# EAGLE schematic sx1509-breakout (EAGLE 7.1.0)
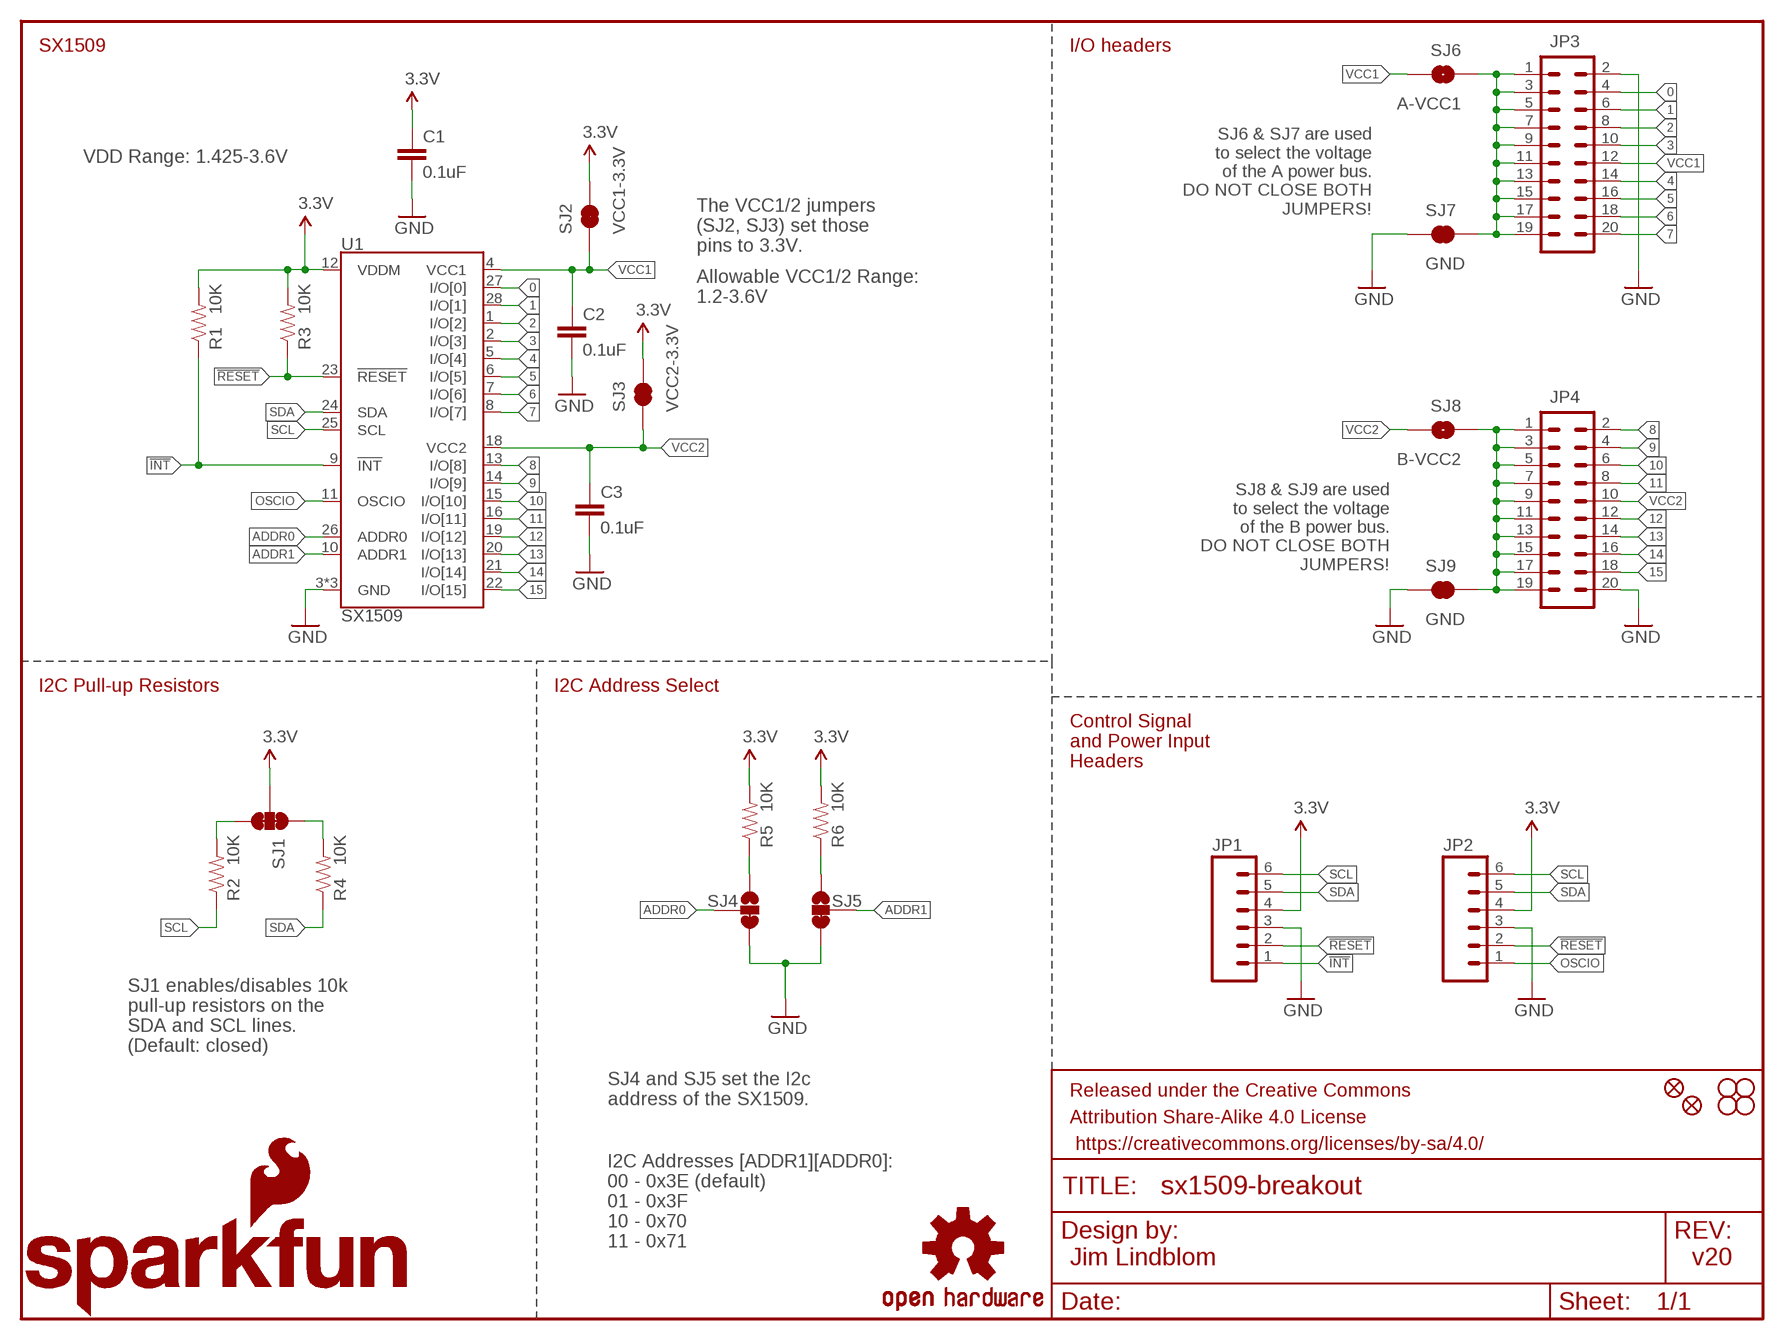
[diagram p0: schematic, sheet 1]

## Parts
C1  0.1uF  0.1UF-25V(+80/-20%)(0603)  [0603-CAP]
C2  0.1uF  0.1UF-25V(+80/-20%)(0603)  [0603-CAP]
C3  0.1uF  0.1UF-25V(+80/-20%)(0603)  [0603-CAP]
FRAME1  FRAME-LETTER  [CREATIVE_COMMONS]
JP1  M06SILK_FEMALE_PTH  [1X06]
JP2  M06SILK_FEMALE_PTH  [1X06]
JP3  M10X2ROUND_NOSILK  [2X10_ROUND_NOSILK]
JP4  M10X2ROUND_NOSILK  [2X10_ROUND_NOSILK]
JP9  FIDUCIAL1X2  [FIDUCIAL-1X2]
JP10  FIDUCIAL1X2  [FIDUCIAL-1X2]
LOGO1  SFE_LOGO_NAME_FLAME.1_INCH  [SFE_LOGO_NAME_FLAME_.1]
LOGO2  SFE_LOGO_FLAME.1_INCH  [SFE_LOGO_FLAME_.1]
LOGO3  OSHW-LOGOS  [OSHW-LOGO-S]
R1  10K  10KOHM-1/10W-1%(0603)0603  [0603-RES]
R2  10K  10KOHM-1/10W-1%(0603)0603  [0603-RES]
R3  10K  10KOHM-1/10W-1%(0603)0603  [0603-RES]
R4  10K  10KOHM-1/10W-1%(0603)0603  [0603-RES]
R5  10K  10KOHM-1/10W-1%(0603)0603  [0603-RES]
R6  10K  10KOHM-1/10W-1%(0603)0603  [0603-RES]
SJ1  JUMPER-PAD-3-NC_BY_TRACE  [PAD-JUMPER-3-3OF3_NC_BY_TRACE_YES_SILK_FULL_BOX]
SJ2  VCC1-3.3V  JUMPER-PAD-2-NC_BY_TRACE  [PAD-JUMPER-2-NC_BY_TRACE_YES_SILK]
SJ3  VCC2-3.3V  JUMPER-PAD-2-NC_BY_TRACE  [PAD-JUMPER-2-NC_BY_TRACE_YES_SILK]
SJ4  JUMPER-PAD-3-2OF3_NC_BY_TRACE_SMALL  [PAD-JUMPER-3-2OF3_NC_BY_TRACE_YES_SILK_FULL_BOX]
SJ5  JUMPER-PAD-3-2OF3_NC_BY_TRACE_SMALL  [PAD-JUMPER-3-2OF3_NC_BY_TRACE_YES_SILK_FULL_BOX]
SJ6  A-VCC1  JUMPER-PAD-2-NO  [PAD-JUMPER-2-NO_NO_SILK]
SJ7  GND  JUMPER-PAD-2-NC_BY_TRACENO_SILK  [PAD-JUMPER-2-NC_BY_TRACE_NO_SILK]
SJ8  B-VCC2  JUMPER-PAD-2-NO  [PAD-JUMPER-2-NO_NO_SILK]
SJ9  GND  JUMPER-PAD-2-NC_BY_TRACENO_SILK  [PAD-JUMPER-2-NC_BY_TRACE_NO_SILK]
STANDOFF1  STAND-OFF  [STAND-OFF]
STANDOFF2  STAND-OFF  [STAND-OFF]
STANDOFF3  STAND-OFF  [STAND-OFF]
STANDOFF4  STAND-OFF  [STAND-OFF]
U1  SX1509  [QFN-28]

## Nets
0: JP3.4 U1.27(I/O[0])
1: JP3.6 U1.28(I/O[1])
2: JP3.8 U1.1(I/O[2])
3: JP3.10 U1.2(I/O[3])
3.3V: C1.1 JP1.4 JP2.4 R1.2 R3.2 R5.2 R6.2 SJ1.2 SJ2.2 SJ3.2 U1.12(VDDM)
4: JP3.14 U1.5(I/O[4])
5: JP3.16 U1.6(I/O[5])
6: JP3.18 U1.7(I/O[6])
7: JP3.20 U1.8(I/O[7])
8: JP4.2 U1.13(I/O[8])
9: JP4.4 U1.14(I/O[9])
10: JP4.6 U1.15(I/O[10])
11: JP4.8 U1.16(I/O[11])
12: JP4.12 U1.19(I/O[12])
13: JP4.14 U1.20(I/O[13])
14: JP4.16 U1.21(I/O[14])
15: JP4.18 U1.22(I/O[15])
!INT: JP1.1 R1.1 U1.9(!INT)
!RESET: JP1.2 JP2.2 R3.1 U1.23(!RESET)
ADDR0: SJ4.2 U1.26(ADDR0)
ADDR1: SJ5.2 U1.10(ADDR1)
GND: C1.2 C2.2 C3.2 JP1.3 JP2.3 JP3.2 JP4.20 SJ4.3 SJ5.3 SJ7.1 SJ9.1 U1.3(GND) U1.17(GND) U1.29(GND)
N$1: R2.2 SJ1.3
N$2: R4.2 SJ1.1
N$3: JP4.1 JP4.3 JP4.5 JP4.7 JP4.9 JP4.11 JP4.13 JP4.15 JP4.17 JP4.19 SJ8.1 SJ9.2
N$8: R5.1 SJ4.1
N$9: R6.1 SJ5.1
OSCIO: JP2.1 U1.11(OSCIO)
PWRBUSA: JP3.1 JP3.3 JP3.5 JP3.7 JP3.9 JP3.11 JP3.13 JP3.15 JP3.17 JP3.19 SJ6.1 SJ7.2
SCL: JP1.6 JP2.6 R2.1 U1.25(SCL)
SDA: JP1.5 JP2.5 R4.1 U1.24(SDA)
VCC1: C2.1 JP3.12 SJ2.1 SJ6.2 U1.4(VCC1)
VCC2: C3.1 JP4.10 SJ3.1 SJ8.2 U1.18(VCC2)

## Notes on the sheet
- SX1509 | I/O headers
- SJ6 & SJ7 are used
  to select the voltage
  of the A power bus.
  DO NOT CLOSE BOTH
  JUMPERS!
- VDD Range: 1.425-3.6V
- The VCC1/2 jumpers 
  (SJ2, SJ3) set those 
  pins to 3.3V.
- Allowable VCC1/2 Range: 
  1.2-3.6V
- SJ8 & SJ9 are used
  to select the voltage
  of the B power bus.
  DO NOT CLOSE BOTH
  JUMPERS!
- I2C Pull-up Resistors | I2C Address Select
- Control Signal
  and Power Input
  Headers
- SJ1 enables/disables 10k
  pull-up resistors on the
  SDA and SCL lines.
  (Default: closed)
- SJ4 and SJ5 set the I2c
  address of the SX1509.
- I2C Addresses [ADDR1][ADDR0]:
  00 - 0x3E (default)
  01 - 0x3F
  10 - 0x70
  11 - 0x71
- Jim Lindblom | v20

## Library data of the parts
C1-C3 = SparkFun-Capacitors:0.1UF-25V(+80/-20%)(0603): CAP-00810 Ceramic Standard decoupling cap; PROD_ID: CAP-00810
FRAME1 = SparkFun-Aesthetics:FRAME-LETTER: Schematic Frame Standard 8.5x11 US Letter frame; DESIGNER: NAME; VERSION: v01
JP1 JP2 = SparkFun-Connectors:M06: Header 6 Standard 6-pin 0.1" header. Use with straight break away headers (SKU : PRT-00116), right angle break away headers (PRT-00553), swiss pins (PRT-00743), machine pins (PRT-00117), and female headers (PRT-00115). Molex polarized connector foot print use with SKU : PRT-08094 with associated crimp pins and housings. NOTES ON THE VARIANTS LOCK and LOCK_LONGPADS... This footprint was designed to help hold the alignment of a through-hole component (i.e. 6-pin header) while soldering it into place. You may notice that each hole has been shifted either up or down by 0.005 of an inch from it's more standard position (which is a perfectly straight line). This slight alteration caused the pins (the squares in the middle) to touch the edges of the holes. Because they are alternating, it causes a "brace" to hold the component in place. 0.005 has proven to be the perfect amount of "off-center" position when using our standard breakaway headers. Although looks a little odd when you look at the bare footprint, once you have a header in there, the alteration is very hard to notice. Also,if you push a header all the way into place, it is covered up entirely on the bottom side. This idea of altering the position of holes to aid alignment will be further integrated into the Sparkfun Library for other footprints. It can help hold any component with 3 or more connection pins.; PROD_ID: CONN-08437
JP3 JP4 = SparkFun-Connectors:M10X2: This was SPECIALLY designed to be used with our Graphic LCD Backpack. Be sure you want to use this! It is not only staggered on each line of header holes, but IT IS ALSO offset of the center point of the top and bottom lines by 5 mil. This causes the headers to lock into place on the "standard" footprint on the LCD screen. The extra squares on the tdocu layer are there simply to reference other pins (if you were to actually populate a longer header than ten long - this is what we do with the backpacks).
JP9 JP10 = SparkFun:FIDUCIAL: Fiducial Alignment Points Various fiducial points for machine vision alignment.
LOGO1 = SparkFun-Aesthetics:SFE_LOGO_NAME_FLAME: SFE Logo, name and flame This is the SparkFun full logo. The logo on the schematic will always be the same size; the package variant is the height of the flame part of the logo. Default layer for the logo on the board is tSilk.
LOGO2 = SparkFun-Aesthetics:SFE_LOGO_FLAME: SFE Logo, flame only This is the SparkFun flame logo. The logo on the schematic will always be the same size; the package variant is the height of the flame. Default layer for the logo on the board is tSilk.
LOGO3 = SparkFun-Aesthetics:OSHW-LOGO: Open Source Hardware Logo This logo indicates the piece of hardware it is found on incorporates a OSHW license and/or adheres to the definition of open source hardware found here: http://freedomdefined.org/OSHW
R1-R6 = SparkFun-Resistors:10KOHM-1/10W-1%(0603): RES-00824; PROD_ID: RES-00824
SJ1 = SparkFun-Passives:JUMPER-PAD-3-NC_BY_TRACE
SJ2 SJ3 SJ7 SJ9 = SparkFun-Passives:JUMPER-PAD-2-NC_BY_TRACE
SJ4 SJ5 = SparkFun-Passives:JUMPER-PAD-3-2OF3_NC_BY_TRACE
SJ6 SJ8 = SparkFun-Passives:JUMPER-PAD-2-NO
STANDOFF1-STANDOFF4 = SparkFun-Electromechanical:STAND-OFF: #4 Stand Off This is the mechanical footprint for a #4 phillips button head screw. Use the keepout ring to avoid running the screw head into surrounding components. SKU : PRT-00447
U1 = SparkFun-DigitalIC:SX1509: Semtech SX1509 The SX1509 is a complete ultra low voltage 1.2V to 3.6V General Purpose parallel Input/Output (GPIO) expanders ideal for low power handheld battery powered equipment. This version comes in a 16-channel configuration and allows easy serial expansion of I/O through a standard 400kHz I2C interface. GPIO devices can provide additional control and monitoring when the microcontroller or chipset has insufficient I/O ports, or in systems where serial communication and control from a remote location is advantageous.; PROD_ID: IC-11311